# EAGLE design Jumper Board V3.0 (EAGLE 9.6.2)
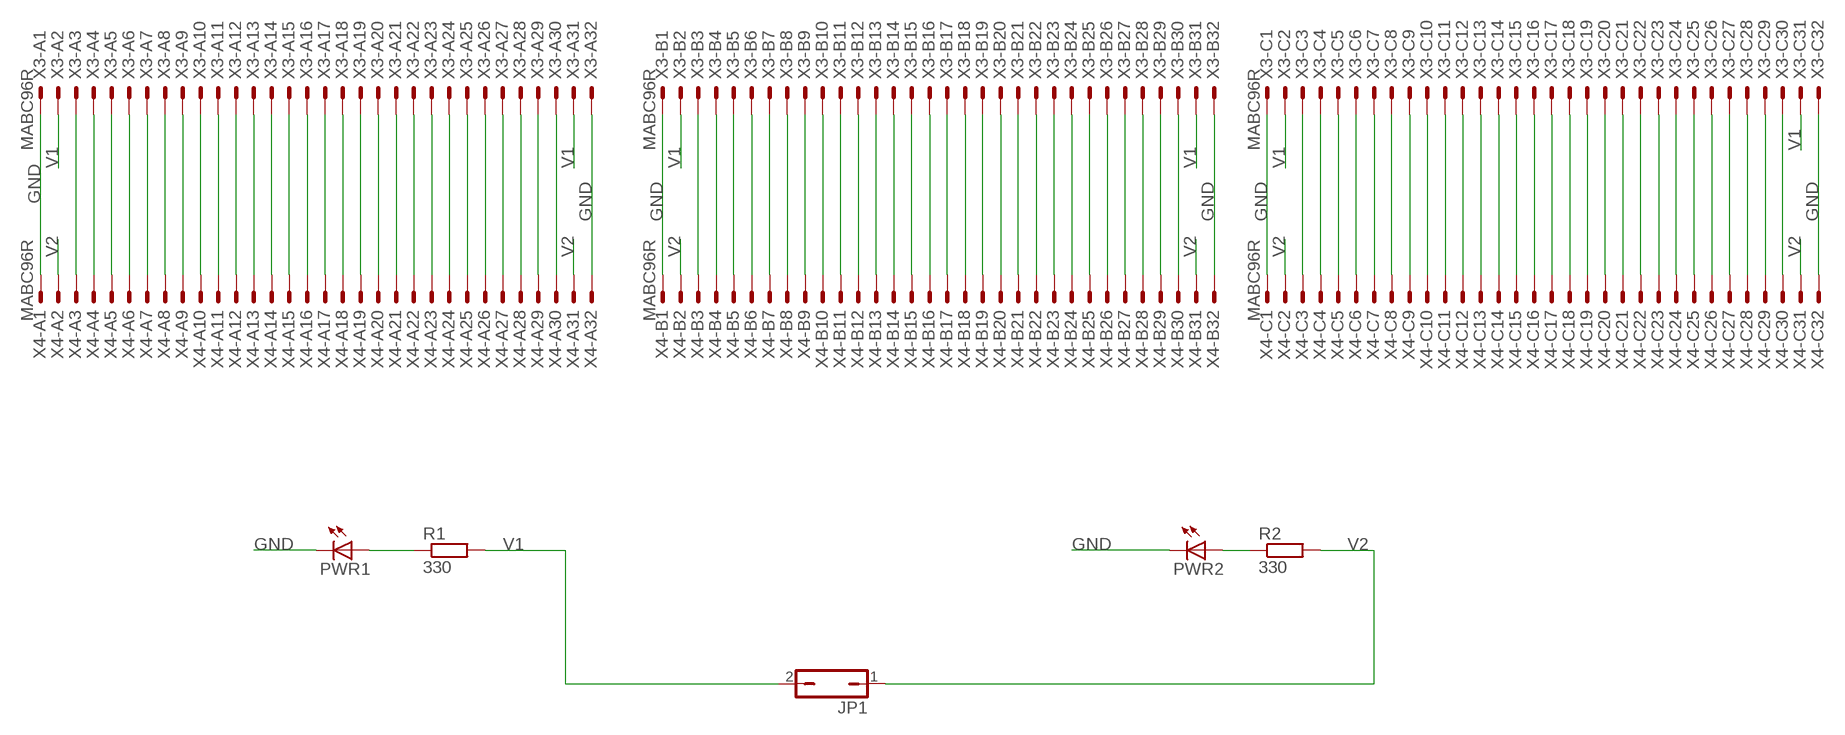
[diagram p0: schematic, sheet 1]

## Parts
JP1  JP1Q  [JP1]
PWR1  LED5MM  [LED5MM]
PWR2  LED5MM  [LED5MM]
R1  330  R0207/10  [0207/10]
R2  330  R0207/10  [0207/10]
X3  MABC96R  [MABC96R]
X4  MABC96R  [MABC96R]

## Nets
GND [GND]: PWR1.K(C) PWR2.K(C) X3.A1 X3.A32 X3.B1 X3.B32 X3.C1 X3.C32 X4.A1 X4.A32 X4.B1 X4.B32 X4.C1 X4.C32
N$4: X3.A3 X4.A3
N$6: X3.A4 X4.A4
N$7: X3.A5 X4.A5
N$8: X3.A6 X4.A6
N$9: X3.A7 X4.A7
N$10: X3.A8 X4.A8
N$11: X3.A9 X4.A9
N$12: X3.A10 X4.A10
N$13: X3.A11 X4.A11
N$14: X3.A12 X4.A12
N$15: X3.A13 X4.A13
N$16: X3.A14 X4.A14
N$17: X3.A15 X4.A15
N$18: X3.A16 X4.A16
N$19: X3.A17 X4.A17
N$20: X3.A18 X4.A18
N$21: X3.A19 X4.A19
N$22: X3.A20 X4.A20
N$23: X3.A21 X4.A21
N$24: X3.A22 X4.A22
N$25: X3.A23 X4.A23
N$26: X3.A24 X4.A24
N$27: X3.A25 X4.A25
N$28: X3.A26 X4.A26
N$29: X3.A27 X4.A27
N$30: X3.A28 X4.A28
N$31: X3.A29 X4.A29
N$32: X3.A30 X4.A30
N$35: PWR1.A R1.1
N$36: PWR2.A R2.1
N$37: X3.B3 X4.B3
N$38: X3.B4 X4.B4
N$39: X3.B5 X4.B5
N$40: X3.B6 X4.B6
N$41: X3.B7 X4.B7
N$42: X3.B8 X4.B8
N$43: X3.B9 X4.B9
N$44: X3.B10 X4.B10
N$45: X3.B11 X4.B11
N$46: X3.B12 X4.B12
N$47: X3.B13 X4.B13
N$48: X3.B14 X4.B14
N$49: X3.B15 X4.B15
N$50: X3.B16 X4.B16
N$51: X3.B17 X4.B17
N$52: X3.B18 X4.B18
N$53: X3.B19 X4.B19
N$54: X3.B20 X4.B20
N$55: X3.B21 X4.B21
N$56: X3.B22 X4.B22
N$57: X3.B23 X4.B23
N$58: X3.B24 X4.B24
N$59: X3.B25 X4.B25
N$60: X3.B26 X4.B26
N$61: X3.B27 X4.B27
N$62: X3.B28 X4.B28
N$63: X3.B29 X4.B29
N$64: X3.B30 X4.B30
N$69: X3.C3 X4.C3
N$70: X3.C4 X4.C4
N$71: X3.C5 X4.C5
N$72: X3.C6 X4.C6
N$73: X3.C7 X4.C7
N$74: X3.C8 X4.C8
N$75: X3.C9 X4.C9
N$76: X3.C10 X4.C10
N$77: X3.C11 X4.C11
N$78: X3.C12 X4.C12
N$79: X3.C13 X4.C13
N$80: X3.C14 X4.C14
N$81: X3.C15 X4.C15
N$82: X3.C16 X4.C16
N$83: X3.C17 X4.C17
N$84: X3.C18 X4.C18
N$85: X3.C19 X4.C19
N$86: X3.C20 X4.C20
N$87: X3.C21 X4.C21
N$88: X3.C22 X4.C22
N$89: X3.C23 X4.C23
N$90: X3.C24 X4.C24
N$91: X3.C25 X4.C25
N$92: X3.C26 X4.C26
N$93: X3.C27 X4.C27
N$94: X3.C28 X4.C28
N$95: X3.C29 X4.C29
N$96: X3.C30 X4.C30
V1 [VCC2]: JP1.2 R1.2 X3.A2 X3.A31 X3.B2 X3.B31 X3.C2 X3.C31
V2 [VCC1]: JP1.1 R2.2 X4.A2 X4.A31 X4.B2 X4.B31 X4.C2 X4.C31

## Library data of the parts
JP1 = jumper:JP1Q: JUMPER
PWR1 PWR2 = led:LED: LED OSRAM: - CHIPLED LG R971, LG N971, LY N971, LG Q971, LY Q971, LO R971, LY R971 LH N974, LH R974 LS Q976, LO Q976, LY Q976 LO Q996 - Hyper CHIPLED LW Q18S LB Q993, LB Q99A, LB R99A - SideLED LS A670, LO A670, LY A670, LG A670, LP A670 LB A673, LV A673, LT A673, LW A673 LH A674 LY A675 LS A676, LA A676, LO A676, LY A676, LW A676 LS A679, LY A679, LG A679 - Hyper Micro SIDELED® LS Y876, LA Y876, LO Y876, LY Y876 LT Y87S - SmartLED LW L88C, LW L88S LB L89C, LB L89S, LG L890 LS L89K, LO L89K, LY L89K LS L896, LA L896, LO L896, LY L896 - TOPLED LS T670, LO T670, LY T670, LG T670, LP T670 LSG T670, LSP T670, LSY T670, LOP T670, LYG T670 LG T671, LOG T671, LSG T671 LB T673, LV T673, LT T673, LW T673 LH T674 LS T676, LA T676, LO T676, LY T676, LB T676, LH T676, LSB T676, LW T676 LB T67C, LV T67C, LT T67C, LS T67K, LO T67K, LY T67K, LW E67C LS E67B, LA E67B, LO E67B, LY E67B, LB E67C, LV E67C, LT E67C LW T67C LS T679, LY T679, LG T679 LS T770, LO T770, LY T770, LG T770, LP T770 LB T773, LV T773, LT T773, LW T773 LH T774 LS E675, LA E675, LY E675, LS T675 LS T776, LA T776, LO T776, LY T776, LB T776 LHGB T686 LT T68C, LB T68C - Hyper Mini TOPLED® LB M676 - Mini TOPLED Santana® LG M470 LS M47K, LO M47K, LY M47K Source: http://www.osram.convergy.de LUXEON: - LUMILED® LXK2-PW12-R00, LXK2-PW12-S00, LXK2-PW14-U00, LXK2-PW14-V00 LXK2-PM12-R00, LXK2-PM12-S00, LXK2-PM14-U00 LXK2-PE12-Q00, LXK2-PE12-R00, LXK2-PE12-S00, LXK2-PE14-T00, LXK2-PE14-U00 LXK2-PB12-K00, LXK2-PB12-L00, LXK2-PB12-M00, LXK2-PB14-N00, LXK2-PB14-P00, LXK2-PB14-Q00 LXK2-PR12-L00, LXK2-PR12-M00, LXK2-PR14-Q00, LXK2-PR14-R00 LXK2-PD12-Q00, LXK2-PD12-R00, LXK2-PD12-S00 LXK2-PH12-R00, LXK2-PH12-S00 LXK2-PL12-P00, LXK2-PL12-Q00, LXK2-PL12-R00 Source: www.luxeon.com KINGBRIGHT: KA-3528ASYC Source: www.kingbright.com
R1 R2 = eagle-ltspice:R: RESISTOR, European symbol; SPICEMODEL: NONE; SPICEPREFIX: R
X3 X4 = con-vg:MABC96R: CONNECTOR male, 96 pins, type R, rows ABC, grid 2.54 mm

## Net classes
1 GND: width 0.508 mm, clearance 0.508 mm
2 VCC1: width 0.508 mm, clearance 0.508 mm
3 VCC2: width 0.508 mm, clearance 0.508 mm

## Board
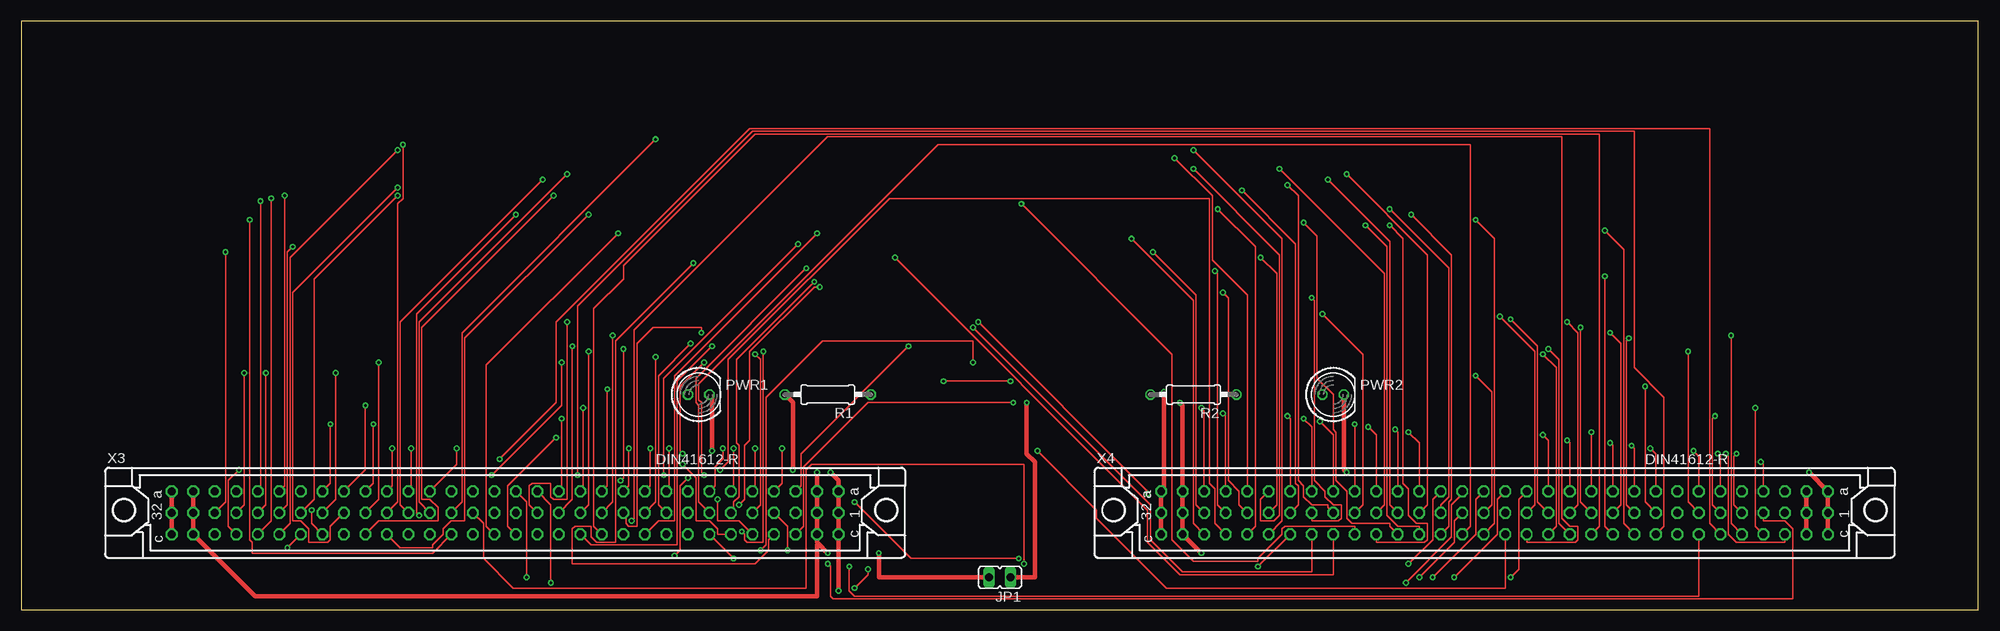
[diagram p1: board, top side]
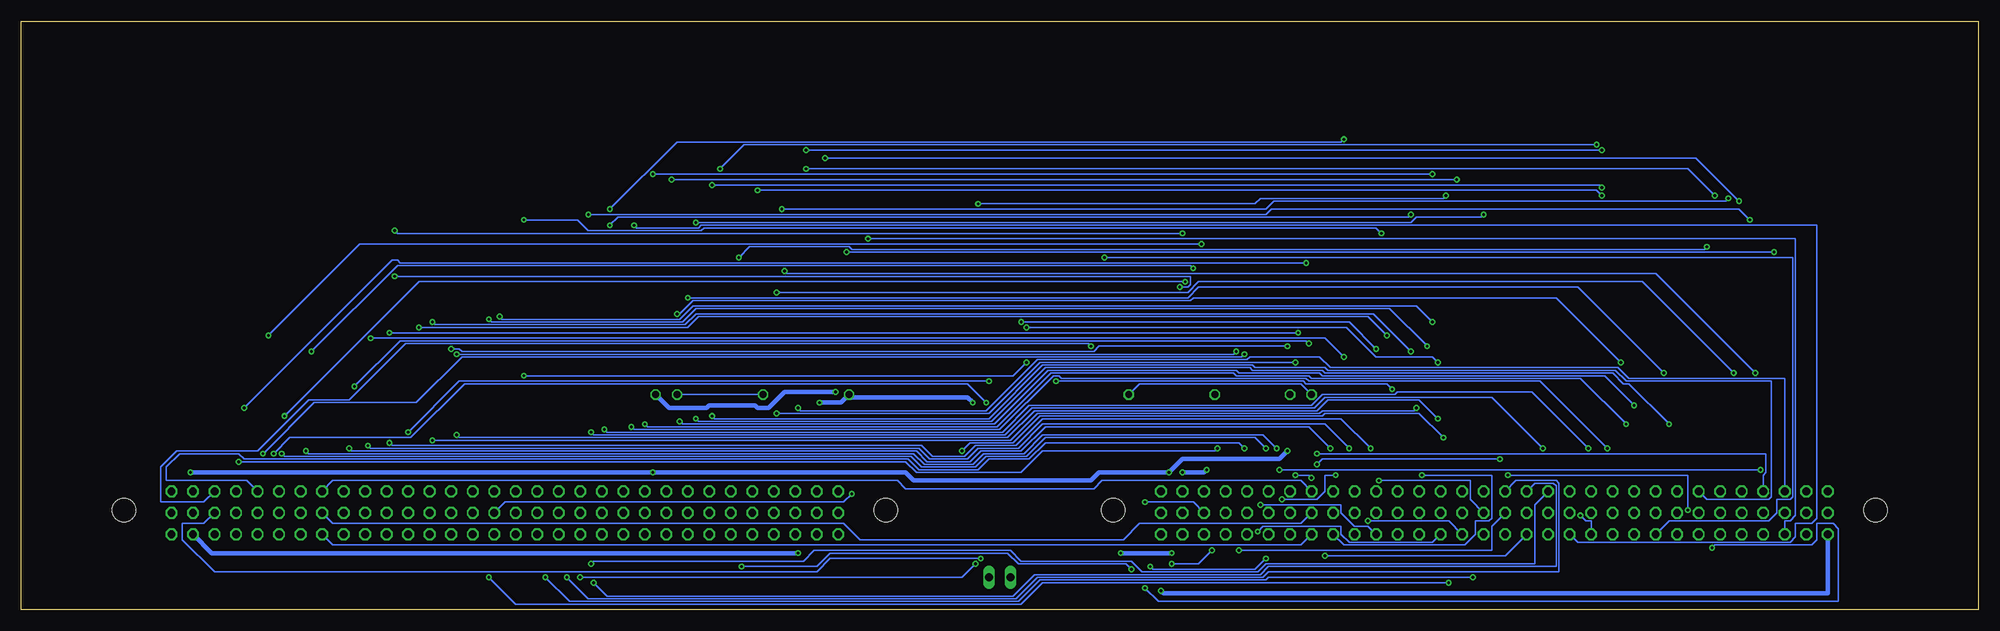
[diagram p2: board, bottom side, seen from below]

Size 231.12 x 69.52 mm. Coordinates in mm from the lower left corner, seen from the top.
Outline: 0,0 231.12,0 231.12,69.52 0,69.52 0,0
Copper layers (1*16): Top 0.0356mm / dielectric 1.5011mm / Bottom 0.0356mm
Design rules "LaenPCBOrder": minimum track width 6mil, minimum drill 13mil, track to track 6mil, track to pad 6mil, pad to pad 6mil, via to via 6mil, smd to smd 6mil, copper to edge 15mil, drill to drill 6mil, minimum pad ring 7mil, minimum via ring 7mil, stop-mask expansion 3mil, vias tented up to drill 0mil, thermal gap 10mil

### Footprints (pad centres in the part's own frame; a part is rotated, then mirrored left to right if it is on the bottom)
JP1 = drill 0.914 long: 1 0,-1.27; 2 0,1.27
LED5MM = drill 0.813 octagon: A -1.27,0; K 1.27,0
0207/10 = drill 0.813 octagon: 1 -5.08,0; 2 5.08,0
MABC96R = drill 0.914 octagon: A1 -2.54,39.37; A2 -2.54,36.83; A3 -2.54,34.29; A4 -2.54,31.75; A5 -2.54,29.21; A6 -2.54,26.67; A7 -2.54,24.13; A8 -2.54,21.59; A9 -2.54,19.05; A10 -2.54,16.51; A11 -2.54,13.97; A12 -2.54,11.43; A13 -2.54,8.89; A14 -2.54,6.35; A15 -2.54,3.81; A16 -2.54,1.27; A17 -2.54,-1.27; A18 -2.54,-3.81; A19 -2.54,-6.35; A20 -2.54,-8.89; A21 -2.54,-11.43; A22 -2.54,-13.97; A23 -2.54,-16.51; A24 -2.54,-19.05; A25 -2.54,-21.59; A26 -2.54,-24.13; A27 -2.54,-26.67; A28 -2.54,-29.21; A29 -2.54,-31.75; A30 -2.54,-34.29; A31 -2.54,-36.83; A32 -2.54,-39.37; B1 0,39.37; B2 0,36.83; B3 0,34.29; B4 0,31.75; B5 0,29.21; B6 0,26.67; B7 0,24.13; B8 0,21.59; B9 0,19.05; B10 0,16.51; B11 0,13.97; B12 0,11.43; B13 0,8.89; B14 0,6.35; B15 0,3.81; B16 0,1.27; B17 0,-1.27; B18 0,-3.81; B19 0,-6.35; B20 0,-8.89; B21 0,-11.43; B22 0,-13.97; B23 0,-16.51; B24 0,-19.05; B25 0,-21.59; B26 0,-24.13; B27 0,-26.67; B28 0,-29.21; B29 0,-31.75; B30 0,-34.29; B31 0,-36.83; B32 0,-39.37; C1 2.54,39.37; C2 2.54,36.83; C3 2.54,34.29; C4 2.54,31.75; C5 2.54,29.21; C6 2.54,26.67; C7 2.54,24.13; C8 2.54,21.59; C9 2.54,19.05; C10 2.54,16.51; C11 2.54,13.97; C12 2.54,11.43; C13 2.54,8.89; C14 2.54,6.35; C15 2.54,3.81; C16 2.54,1.27; C17 2.54,-1.27; C18 2.54,-3.81; C19 2.54,-6.35; C20 2.54,-8.89; C21 2.54,-11.43; C22 2.54,-13.97; C23 2.54,-16.51; C24 2.54,-19.05; C25 2.54,-21.59; C26 2.54,-24.13; C27 2.54,-26.67; C28 2.54,-29.21; C29 2.54,-31.75; C30 2.54,-34.29; C31 2.54,-36.83; C32 2.54,-39.37 | hole 2.794: -0.305,45; -0.305,-45

### Placement (x,y rotation side)
JP1  115.57,3.81 90 top
PWR1  80.01,25.4 0 top
PWR2  154.94,25.4 0 top
R1  95.25,25.4 180 top
R2  138.43,25.4 180 top
X3  57.15,11.43 270 top
X4  173.99,11.43 270 top

### Tracks (layer width: path | path; a pad name or v marks a point on that pad's centre or on a via)
GND  (via drill 0.33)
  Top 0.508: X4.C1 X4.B1 X4.A1 v211.14,16.19 | X4.C32 X4.B32 X4.A32 134.94,14.29 v134.94,25.72 | v156.53,16.19 156.21,16.51 PWR2.K | X3.C32 X3.B32 X3.A32 | PWR1.K 81.6,25.08 v81.6,18.73 | v95.57,16.19 96.52,15.24 X3.A1 X3.B1 X3.C1 v96.52,2.22
  Bottom 0.508: PWR2.K 154.62,23.81 150.18,23.81 149.86,24.13 144.46,24.13 144.15,23.81 142.88,23.81 140.97,25.72 v134.94,25.72 | v211.14,16.19 v156.53,16.19 126.68,16.19 125.73,15.24 104.78,15.24 103.82,16.19 v95.57,16.19 93.98,17.78 82.55,17.78 v81.6,18.73 | X3.C32 17.78,1.91 96.2,1.91 v96.52,2.22
N$4  (via drill 0.33)
  Top 0.152: X3.A3 92.08,14.61 92.08,18.41 v104.78,31.11
  Bottom 0.152: v104.78,31.11 105.09,31.43 185.74,31.43 192.41,24.77 197.17,24.77 203.2,18.73 212.72,18.73 214.63,16.83 214.63,12.7 209.55,12.7 X4.A3
N$6  (via drill 0.33)
  Top 0.152: X3.A4 89.85,14.92 v89.85,19.05 | v205.42,17.46 205.74,17.14 X4.A4
  Bottom 0.152: v89.85,19.05 90.17,18.73 110.49,18.73 113.03,16.19 125.41,16.19 126.68,17.46 v205.42,17.46
N$7  (via drill 0.33)
  Top 0.152: X3.A5 86.68,14.29 v86.68,19.05
  Bottom 0.152: v86.68,19.05 87.31,19.68 110.17,19.68 112.08,17.78 116.84,17.78 118.11,16.51 125.09,16.51 126.36,17.78 204.79,17.78 205.42,18.41 212.41,18.41 214,16.83 214,15.24 204.47,15.24 X4.A5
N$8  (via drill 0.33)
  Top 0.152: X3.A6 84.14,14.29 v84.14,19.05 | v200.34,18.41 200.66,18.1 X4.A6
  Bottom 0.152: v84.14,19.05 85.41,20.32 110.17,20.32 112.39,18.1 117.16,18.1 118.43,16.83 124.78,16.83 126.05,18.1 200.03,18.1 v200.34,18.41
N$9  (via drill 0.33)
  Top 0.152: X3.A7 81.92,14.61 81.92,16.83 82.87,17.78 v82.87,19.05 | v197.49,18.73 198.12,18.1 X4.A7
  Bottom 0.152: v82.87,19.05 84.45,20.64 110.49,20.64 112.71,18.41 117.47,18.41 118.75,17.14 124.46,17.14 125.73,18.41 197.17,18.41 v197.49,18.73
N$10
  Bottom 0.152: X3.A8 80.01,15.24 103.5,15.24 104.46,14.29 126.68,14.29 127.64,15.24 194.31,15.24 X4.A8
N$11  (via drill 0.33)
  Top 0.152: X3.A9 76.52,14.29 v76.52,19.05 | v192.41,19.05 193.04,18.41 X4.A9
  Bottom 0.152: v76.52,19.05 79.06,21.59 110.17,21.59 113.03,18.73 117.79,18.73 119.06,17.46 124.14,17.46 125.41,18.73 192.09,18.73 v192.41,19.05
N$12  (via drill 0.33)
  Top 0.152: X3.A10 74.3,14.61 v74.3,19.05 | v190.18,19.37 190.5,19.05 X4.A10
  Bottom 0.152: v74.3,19.05 77.15,21.91 110.49,21.91 113.35,19.05 118.11,19.05 119.38,17.78 123.83,17.78 125.09,19.05 189.87,19.05 v190.18,19.37
N$13  (via drill 0.33)
  Top 0.152: X3.A11 71.75,14.61 v71.75,19.05 | v187.64,19.68 187.96,19.37 X4.A11
  Bottom 0.152: v71.75,19.05 75.25,22.54 110.49,22.54 113.67,19.37 118.43,19.37 119.7,18.1 123.51,18.1 124.78,19.37 187.32,19.37 v187.64,19.68
N$14  (via drill 0.33)
  Top 0.152: X3.A12 69.22,14.61 v69.22,26.04 | v116.84,26.99 v108.9,26.99 | X4.A12 v185.42,20.95
  Bottom 0.152: v69.22,26.04 69.85,26.67 79.38,26.67 79.69,26.99 v108.9,26.99 | v116.84,26.99 179.39,26.99 v185.42,20.95
N$15  (via drill 0.33)
  Top 0.152: X3.A13 66.36,14.29 v66.36,23.81 | v182.56,20 182.88,19.68 X4.A13
  Bottom 0.152: v66.36,23.81 66.67,23.5 77.47,23.5 77.79,23.18 111.12,23.18 114.3,20 v182.56,20
N$16  (via drill 0.33)
  Top 0.152: X3.A14 63.82,14.29 v63.82,22.54 | v179.71,20.64 180.34,20 X4.A14
  Bottom 0.152: v63.82,22.54 66.04,24.77 76.83,24.77 78.11,23.5 111.44,23.5 114.62,20.32 179.39,20.32 v179.71,20.64
N$17  (via drill 0.33)
  Top 0.152: X3.A15 62.55,12.38 v62.55,3.17 | v175.9,3.81 176.85,4.76 176.85,13.02 X4.A15
  Bottom 0.152: v62.55,3.17 110.49,3.17 113.03,0.64 172.72,0.64 v175.9,3.81
N$18  (via drill 0.33)
  Top 0.152: X3.A16 59.69,12.7 v59.69,3.81 | v169.23,3.81 174.31,8.89 174.31,13.02 X4.A16
  Bottom 0.152: v59.69,3.81 83.82,3.81 84.14,3.49 110.81,3.49 113.35,0.95 166.37,0.95 v169.23,3.81
N$19  (via drill 0.33)
  Top 0.152: v166.69,3.81 171.77,8.89 171.77,13.02 X4.A17
  Bottom 0.152: X3.A17 54.61,15.24 49.85,15.24 49.53,14.92 49.53,4.45 83.82,4.45 84.45,3.81 111.12,3.81 113.67,1.27 164.15,1.27 v166.69,3.81
N$20  (via drill 0.33)
  Top 0.152: v163.51,3.17 168.91,8.57 168.91,12.38 170.18,13.65 X4.A18
  Bottom 0.152: X3.A18 52.39,14.92 50.16,14.92 49.85,14.61 49.85,5.08 83.82,5.08 84.77,4.13 111.44,4.13 113.98,1.59 161.93,1.59 v163.51,3.17
N$21  (via drill 0.33)
  Top 0.152: v163.83,5.4 166.69,8.26 166.69,13.02 X4.A19
  Bottom 0.152: X3.A19 52.39,12.38 52.39,5.4 84.14,5.4 85.09,4.45 98.74,4.45 100.01,5.71 113.03,5.71 114.3,6.99 137.48,6.99 138.75,5.71 163.51,5.71 v163.83,5.4
N$22  (via drill 0.33)
  Top 0.152: X3.A20 51.44,17.14 v51.44,19.05 | v163.83,20.95 165.1,19.68 X4.A20
  Bottom 0.152: v51.44,19.05 57.47,25.08 77.15,25.08 78.42,23.81 111.76,23.81 114.94,20.64 163.51,20.64 v163.83,20.95
N$23  (via drill 0.33)
  Top 0.152: X3.A21 46.04,14.29 v46.04,19.05 | v162.24,21.27 162.56,20.95 X4.A21
  Bottom 0.152: v46.04,19.05 52.7,25.72 68.58,25.72 68.9,25.4 77.47,25.4 78.74,24.13 112.08,24.13 115.25,20.95 161.93,20.95 v162.24,21.27
N$24  (via drill 0.33)
  Top 0.152: X3.A22 43.81,14.61 v43.81,19.05 | v159.07,21.59 160.02,20.64 X4.A22
  Bottom 0.152: v43.81,19.05 51.75,26.99 79.06,26.99 79.38,27.3 108.27,27.3 108.58,27.62 109.22,27.62 115.57,21.27 158.75,21.27 v159.07,21.59
N$25  (via drill 0.33)
  Top 0.152: X3.A23 41.59,14.92 v41.59,21.91 | X4.A23 v157.48,21.91
  Bottom 0.152: v41.59,21.91 46.99,27.3 78.74,27.3 79.06,27.62 87.63,27.62 87.95,27.94 109.54,27.94 115.89,21.59 157.16,21.59 v157.48,21.91
N$26  (via drill 0.33)
  Top 0.152: X3.A24 40.64,16.51 v40.64,24.13 | v153.35,22.23 154.94,20.64 X4.A24
  Bottom 0.152: v40.64,24.13 44.13,27.62 77.47,27.62 77.79,27.94 87.31,27.94 87.63,28.26 109.86,28.26 116.2,21.91 153.03,21.91 v153.35,22.23
N$27  (via drill 0.33)
  Top 0.152: X3.A25 36.51,14.92 v36.51,21.91 | v151.45,22.54 152.4,21.59 X4.A25
  Bottom 0.152: v36.51,21.91 41.27,26.67 41.91,26.67 43.18,27.94 77.15,27.94 77.47,28.26 85.72,28.26 86.04,28.57 110.17,28.57 116.52,22.23 151.13,22.23 v151.45,22.54
N$28  (via drill 0.33)
  Top 0.152: v149.54,22.86 149.86,22.54 X4.A26
  Bottom 0.152: X3.A26 32.07,13.02 24.77,13.02 24.45,13.34 24.45,26.99 41.59,26.99 42.86,28.26 76.83,28.26 77.15,28.57 85.41,28.57 85.72,28.89 110.49,28.89 116.84,22.54 149.22,22.54 v149.54,22.86
N$29  (via drill 0.33)
  Top 0.152: X3.A27 31.11,14.61 v31.11,48.9 | v138.43,52.07 148.59,41.91 148.59,11.11 147.96,10.48 146.37,10.48 146.37,13.02 X4.A27
  Bottom 0.152: v31.11,48.9 34.29,52.07 v138.43,52.07
N$30  (via drill 0.33)
  Top 0.152: X3.A28 28.26,14.29 v28.26,48.26 | v136.21,53.34 140.65,48.9 140.65,41.27 144.78,37.15 X4.A28
  Bottom 0.152: v28.26,48.26 33.34,53.34 v136.21,53.34
N$31  (via drill 0.33)
  Top 0.152: v78.11,18.41 77.79,18.73 77.79,26.35 v80.64,29.21 | v141.92,23.18 142.24,22.86 X4.A29
  Bottom 0.152: X3.A29 25.4,15.88 25.08,16.19 25.08,18.41 v78.11,18.41 | v80.64,29.21 110.81,29.21 116.84,23.18 v141.92,23.18
N$32  (via drill 0.33)
  Top 0.152: v139.38,23.81 139.7,23.5 X4.A30
  Bottom 0.152: X3.A30 22.86,27.3 41.27,27.3 42.55,28.57 76.52,28.57 77.79,29.84 86.04,29.84 86.36,29.53 111.12,29.53 117.16,23.5 139.06,23.5 v139.38,23.81
N$35
  Bottom 0.152: PWR1.A 80.01,26.67 99.06,26.67 R1.1
N$36
  Bottom 0.152: PWR2.A R2.1
N$37  (via drill 0.33)
  Top 0.152: v98.42,12.7 105.09,6.03 v117.79,6.03
  Bottom 0.152: X3.B3 92.71,12.7 v98.42,12.7 | v117.79,6.03 135.57,6.03 137.16,4.45 208.28,4.45 212.09,8.26 212.09,10.16 209.55,10.16 X4.B3
N$38  (via drill 0.33)
  Top 0.152: X3.B4 90.49,9.84 v90.49,6.99 | v95.25,5.4 95.57,5.08 95.57,1.59 95.89,1.27 209.23,1.27 209.23,9.53 208.28,10.48 205.74,10.48 X4.B4
  Bottom 0.152: v90.49,6.99 92.08,5.4 v95.25,5.4
N$39  (via drill 0.33)
  Top 0.152: X3.B5 87.31,12.38 87.31,29.53 v86.68,30.16 | v202.56,18.41 202.25,18.1 202.25,12.38 X4.B5
  Bottom 0.152: v86.68,30.16 87,29.84 179.07,29.84 184.47,24.45 196.53,24.45 v202.56,18.41
N$40  (via drill 0.33)
  Top 0.152: X3.B6 84.14,11.75 84.14,12.7 84.77,13.34 84.77,19.37 84.45,19.68 84.45,29.53 v93.66,38.73 | v200.03,22.86 199.71,22.54 199.71,12.38 X4.B6
  Bottom 0.152: v93.66,38.73 184.15,38.73 v200.03,22.86
N$41  (via drill 0.33)
  Top 0.152: X3.B7 80.01,12.7 80.01,24.13 79.69,24.45 79.69,27.3 v92.71,40.32 | v196.85,30.48 196.85,12.7 X4.B7
  Bottom 0.152: v92.71,40.32 93.03,40.64 186.69,40.64 v196.85,30.48
N$42
  Bottom 0.152: X3.B8 80.01,10.16 99.06,10.16 100.97,8.26 132.08,8.26 133.99,10.16 194.31,10.16 X4.B8
N$43  (via drill 0.33)
  Top 0.152: X3.B9 75.25,12.38 75.25,27.62 v79.06,31.43 | v191.77,26.35 191.77,12.7 X4.B9
  Bottom 0.152: v79.06,31.43 79.38,31.75 186.37,31.75 v191.77,26.35
N$44  (via drill 0.33)
  Top 0.152: X3.B10 74.93,12.7 v74.93,29.84 | v189.87,32.07 189.55,31.75 189.55,12.38 X4.B10
  Bottom 0.152: v74.93,29.84 77.15,32.07 v189.87,32.07
N$45  (via drill 0.33)
  Top 0.152: X3.B11 71.44,11.11 71.44,10.16 71.75,9.84 72.71,9.84 72.71,31.43 74.61,33.34 80.33,33.34 v80.33,32.7 | v187.64,32.7 188.91,31.43 188.91,12.38 X4.B11
  Bottom 0.152: v187.64,32.7 v80.33,32.7
N$46  (via drill 0.33)
  Top 0.152: X3.B12 69.85,12.7 v69.85,32.38 | v184.15,33.34 184.15,12.7 X4.B12
  Bottom 0.152: v69.85,32.38 72.07,34.61 151.13,34.61 152.4,33.34 v184.15,33.34
N$47  (via drill 0.33)
  Top 0.152: X3.B13 66.99,12.38 v66.99,30.48 | v182.56,33.97 183.83,32.7 183.83,12.38 X4.B13
  Bottom 0.152: v66.99,30.48 71.44,34.92 151.45,34.92 152.72,33.66 182.25,33.66 v182.56,33.97
N$48  (via drill 0.33)
  Top 0.152: X3.B14 65.09,13.02 v65.09,31.11 | v175.9,34.29 179.07,31.11 179.07,12.7 X4.B14
  Bottom 0.152: v65.09,31.11 69.53,35.56 151.45,35.56 153.03,33.97 175.58,33.97 v175.9,34.29
N$49  (via drill 0.33)
  Top 0.152: X3.B15 60.01,12.38 60.01,14.61 60.33,14.92 62.55,14.92 62.55,13.34 62.87,13.02 64.45,13.02 v64.45,33.97 | v174.62,34.61 178.75,30.48 178.75,12.38 X4.B15
  Bottom 0.152: v64.45,33.97 66.36,35.88 151.76,35.88 153.35,34.29 174.31,34.29 v174.62,34.61
N$50  (via drill 0.33)
  Top 0.152: v70.8,15.24 71.12,15.56 v71.12,30.8 | v113.03,33.97 133.03,13.97 v133.03,13.65
  Bottom 0.152: X3.B16 60.01,13.02 60.01,15.24 v70.8,15.24 | v71.12,30.8 74.3,33.97 v113.03,33.97 | v133.03,13.65 133.99,12.7 173.99,12.7 X4.B16
N$51  (via drill 0.33)
  Top 0.152: v87.31,6.99 87.95,7.62 87.95,25.08 94.61,31.75 112.39,31.75 v112.39,29.21 | v171.77,27.62 173.67,25.72 173.67,12.38 X4.B17
  Bottom 0.152: X3.B17 57.47,9.84 57.47,6.99 v87.31,6.99 | v112.39,29.21 113.98,27.62 v171.77,27.62
N$52  (via drill 0.33)
  Top 0.152: X3.B18 54.61,10.16 54.61,6.03 58.1,2.54 92.71,2.54 92.71,16.51 93.34,17.14 118.43,17.14 v118.43,5.4 | v165.1,3.81 169.23,7.94 169.23,10.48 X4.B18
  Bottom 0.152: v118.43,5.4 120.02,3.81 v165.1,3.81
N$53  (via drill 0.33)
  Top 0.152: X3.B19 52.07,12.7 52.07,32.7 v74.93,55.56 | v161.61,47.31 168.59,40.32 168.59,13.34 167.64,12.38 X4.B19
  Bottom 0.152: v74.93,55.56 75.25,55.24 153.67,55.24 v161.61,47.31
N$54  (via drill 0.33)
  Top 0.152: X3.B20 46.99,12.7 46.99,33.97 v64.45,51.44 | v156.53,51.44 166.05,41.91 166.05,12.38 X4.B20
  Bottom 0.152: v156.53,51.44 v64.45,51.44
N$55  (via drill 0.33)
  Top 0.152: X3.B21 44.77,12.38 44.77,33.97 v61.59,50.8 | v154.31,50.8 161.61,43.5 161.61,12.38 X4.B21
  Bottom 0.152: v154.31,50.8 v61.59,50.8
N$56  (via drill 0.33)
  Top 0.152: X3.B22 44.45,12.7 44.45,47.94 45.09,48.58 v45.09,54.93 | v148.59,52.07 160.97,39.69 160.97,12.38 X4.B22
  Bottom 0.152: v45.09,54.93 145.73,54.93 v148.59,52.07
N$57  (via drill 0.33)
  Top 0.152: X3.B23 42.23,13.02 v42.23,29.21 | v153.67,34.92 158.43,30.16 158.43,12.38 X4.B23
  Bottom 0.152: v42.23,29.21 49.85,36.83 92.71,36.83 93.03,36.51 151.76,36.51 153.35,34.92 v153.67,34.92
N$58  (via drill 0.33)
  Top 0.152: X3.B24 36.51,9.84 36.51,8.26 36.2,7.94 33.97,7.94 33.97,9.53 33.02,10.48 32.07,10.48 32.07,37.47 v44.45,49.85 | v149.54,50.16 150.81,48.9 150.81,15.24 151.45,14.61 151.45,13.34 152.4,12.38 154.31,12.38 154.31,12.06 X4.B24
  Bottom 0.152: v44.45,49.85 44.77,50.16 v149.54,50.16
N$59  (via drill 0.33)
  Top 0.152: X3.B25 37.15,13.02 v37.15,27.94 | v152.4,36.83 152.72,36.51 152.72,15.24 153.99,13.97 153.99,13.34 154.94,12.38 155.89,12.38 155.89,10.79 155.57,10.48 152.4,10.48 X4.B25
  Bottom 0.152: v37.15,27.94 47.31,38.1 92.08,38.1 93.34,36.83 v152.4,36.83
N$60  (via drill 0.33)
  Top 0.152: X3.B26 34.61,13.02 34.61,39.05 v44.45,48.9 | v144.15,49.53 150.5,43.18 150.5,14.92 150.81,14.61 150.81,12.38 X4.B26
  Bottom 0.152: v44.45,48.9 45.09,49.53 v144.15,49.53
N$61  (via drill 0.33)
  Top 0.152: X3.B27 31.43,12.38 31.43,42.23 v32.07,42.86 | v146.37,41.59 148.27,39.69 148.27,12.38 X4.B27
  Bottom 0.152: v32.07,42.86 32.38,42.55 133.03,42.55 133.35,42.86 145.1,42.86 v146.37,41.59
N$62  (via drill 0.33)
  Top 0.152: X3.B28 28.89,12.38 v28.89,27.94 | v141.92,37.47 142.56,36.83 142.56,15.24 143.83,13.97 143.83,12.38 X4.B28
  Bottom 0.152: v28.89,27.94 39.69,38.73 92.08,38.73 93.34,37.47 v141.92,37.47
N$63  (via drill 0.33)
  Top 0.152: X3.B29 26.35,12.38 v26.35,27.94 | v140.97,40.01 141.29,39.69 141.29,12.38 X4.B29
  Bottom 0.152: v26.35,27.94 38.1,39.69 140.65,39.69 v140.97,40.01
N$64  (via drill 0.33)
  Top 0.152: X3.B30 24.13,12.7 v24.13,42.23 | v133.67,42.23 138.75,37.15 138.75,12.38 X4.B30
  Bottom 0.152: v133.67,42.23 v24.13,42.23
N$69  (via drill 0.33)
  Top 0.152: X3.C3 92.39,9.84 92.39,16.83 100.01,24.45 v117.16,24.45 | v201.29,18.41 201.61,18.1 201.61,8.89 202.56,7.94 208.28,7.94 X4.C3
  Bottom 0.152: v117.16,24.45 119.38,26.67 178.75,26.67 185.1,20.32 199.39,20.32 v201.29,18.41
N$70  (via drill 0.33)
  Top 0.152: X3.C4 88.27,8.26 88.27,6.99 86.68,5.4 65.09,5.4 65.09,9.53 65.41,9.84 67.31,9.84 67.31,8.57 67.94,7.94 70.17,7.94 70.17,31.75 v79.38,40.96 | v204.79,23.81 204.79,9.84 X4.C4
  Bottom 0.152: v79.38,40.96 186.37,40.96 186.69,41.27 187.32,41.27 v204.79,23.81
N$71  (via drill 0.33)
  Top 0.152: X3.C5 84.77,10.48 82.23,10.48 v82.23,13.02 | v75.88,15.88 75.88,27.3 v91.76,43.18 | v201.93,32.38 201.93,10.16 X4.C5
  Bottom 0.152: v82.23,13.02 78.11,13.02 77.15,13.97 77.15,15.88 v75.88,15.88 | v91.76,43.18 191.13,43.18 v201.93,32.38
N$72  (via drill 0.33)
  Top 0.152: X3.C6 82.23,8.89 82.23,9.53 81.28,10.48 79.69,10.48 79.69,15.56 v78.11,17.14 | v56.52,17.78 63.18,24.45 63.18,33.97 86.04,56.83 199.39,56.83 199.39,10.16 X4.C6
  Bottom 0.152: v78.11,17.14 77.47,17.78 v56.52,17.78
N$73  (via drill 0.33)
  Top 0.152: v84.14,6.03 X3.C7 | v97.79,5.08 97.79,2.22 98.42,1.59 198.12,1.59 X4.C7
  Bottom 0.152: v84.14,6.03 85.41,4.76 97.47,4.76 v97.79,5.08
N$74
  Bottom 0.152: X3.C8 80.01,7.62 194.31,7.62 X4.C8
N$75  (via drill 0.33)
  Top 0.152: v65.72,15.88 65.72,35.88 86.36,56.52 190.5,56.52 190.5,28.57 193.99,25.08 193.99,9.84 X4.C9
  Bottom 0.152: X3.C9 74.93,7.62 60.64,7.62 59.37,8.89 59.37,10.48 57.78,10.48 57.47,10.79 57.47,15.88 v65.72,15.88
N$76  (via drill 0.33)
  Top 0.152: X3.C10 75.25,10.48 77.15,10.48 77.15,27.62 v93.98,44.45 | v187.01,44.77 189.23,42.55 189.23,10.16 X4.C10
  Bottom 0.152: v93.98,44.45 186.69,44.45 v187.01,44.77
N$77  (via drill 0.33)
  Top 0.152: v84.77,12.38 85.41,13.02 85.41,19.37 86.04,20 86.04,30.48 93.66,38.1 v94.3,38.1 | v187.01,39.37 187.01,9.84 X4.C11
  Bottom 0.152: X3.C11 72.07,9.84 73.66,9.84 75.25,11.43 75.25,12.38 v84.77,12.38 | v94.3,38.1 93.34,38.1 93.03,38.42 93.03,39.37 v187.01,39.37
N$78
  Top 0.152: X3.C12 67.63,9.84 67.63,35.56 71.12,39.05 71.12,40.64 86.68,56.2 186.37,56.2 186.37,9.84 X4.C12
N$79  (via drill 0.33)
  Top 0.152: X3.C13 67.31,7.62 77.47,7.62 77.47,26.99 v81.6,31.11 | v180.34,30.8 181.61,29.53 181.61,10.16 X4.C13
  Bottom 0.152: v81.6,31.11 103.82,31.11 104.46,30.48 179.07,30.48 179.39,30.8 v180.34,30.8
N$80  (via drill 0.33)
  Top 0.152: v85.09,9.21 85.41,8.89 85.41,8.26 85.72,7.94 87.63,7.94 v87.63,30.48 | v179.71,30.16 181.29,28.57 181.29,9.84 X4.C14
  Bottom 0.152: X3.C14 64.45,7.94 74.3,7.94 75.25,8.89 75.25,9.84 84.45,9.84 v85.09,9.21 | v87.63,30.48 87.95,30.16 v179.71,30.16
N$81  (via drill 0.33)
  Top 0.152: v72.07,10.48 72.39,10.79 72.39,33.02 95.25,55.88 181.93,55.88 181.93,10.79 182.88,9.84 183.83,9.84 183.83,8.26 183.51,7.94 177.8,7.94 X4.C15
  Bottom 0.152: X3.C15 62.55,10.48 v72.07,10.48
N$82  (via drill 0.33)
  Top 0.152: X3.C16 57.47,9.84 57.47,14.61 v63.18,20.32 | v120.02,18.73 127,11.75 127,10.79 135.25,2.54 175.26,2.54 X4.C16
  Bottom 0.152: v63.18,20.32 66.04,23.18 77.15,23.18 77.47,22.86 110.81,22.86 113.98,19.68 119.06,19.68 v120.02,18.73
N$83  (via drill 0.33)
  Top 0.152: X3.C17 54.93,9.84 54.93,28.89 v70.48,44.45 | v171.77,46.04 173.99,43.81 173.99,10.16 X4.C17
  Bottom 0.152: v70.48,44.45 71.12,45.09 150.5,45.09 150.81,44.77 164.15,44.77 165.42,46.04 v171.77,46.04
N$84  (via drill 0.33)
  Top 0.152: v77.15,6.35 77.79,6.99 77.79,14.61 v78.74,15.56 | v80.64,15.88 80.33,16.19 80.33,24.45 80.01,24.77 80.01,26.67 108.27,54.93 171.13,54.93 171.13,9.84 X4.C18
  Bottom 0.152: X3.C18 55.88,6.35 v77.15,6.35 | v78.74,15.56 79.06,15.88 v80.64,15.88
N$85  (via drill 0.33)
  Top 0.152: X3.C19 48.58,6.67 27.3,6.67 27.3,7.94 26.99,8.26 v26.99,46.04 | v164.15,46.67 168.91,41.91 168.91,13.02 168.59,12.7 168.59,9.84 X4.C19
  Bottom 0.152: v26.99,46.04 28.26,47.31 83.5,47.31 84.14,46.67 v164.15,46.67
N$86  (via drill 0.33)
  Top 0.152: v158.75,45.4 161.29,42.86 161.29,11.11 162.56,9.84 165.1,9.84 X4.C20
  Bottom 0.152: X3.C20 47.31,7.94 22.23,7.94 21.59,8.57 21.59,10.16 19.68,10.16 19.05,10.79 19.05,45.4 150.81,45.4 151.13,45.09 158.43,45.09 v158.75,45.4
N$87  (via drill 0.33)
  Top 0.152: v46.99,11.11 46.67,11.43 46.67,34.92 v58.42,46.67 | v151.45,45.72 153.03,44.13 153.03,27.3 154.94,25.4 154.94,21.27 155.26,20.95 155.26,15.24 156.53,13.97 156.53,10.79 157.16,10.16 161.61,10.16 161.61,9.84 X4.C21
  Bottom 0.152: X3.C21 45.72,10.48 46.35,10.48 v46.99,11.11 | v58.42,46.67 58.74,46.35 66.36,46.35 66.99,45.72 v151.45,45.72
N$88  (via drill 0.33)
  Top 0.152: X3.C22 44.77,7.3 48.58,7.3 48.58,7.62 49.85,8.89 49.85,9.53 50.8,10.48 52.39,10.48 52.39,32.07 v66.99,46.67 | v161.61,45.4 163.19,43.81 163.19,14.92 163.83,14.29 163.83,11.11 164.78,10.16 166.05,10.16 166.05,8.26 165.74,7.94 160.02,7.94 X4.C22
  Bottom 0.152: v66.99,46.67 67.31,46.35 160.66,46.35 v161.61,45.4
N$89  (via drill 0.33)
  Top 0.152: X3.C23 42.23,10.48 49.21,10.48 49.21,12.06 48.26,13.02 47.31,13.02 47.31,33.34 v62.87,48.9 | v118.11,47.94 135.89,30.16 135.89,8.26 138.43,5.71 146.05,5.71 146.05,6.03 148.91,8.89 148.91,9.53 149.22,9.84 157.48,9.84 X4.C23
  Bottom 0.152: v62.87,48.9 63.18,48.58 84.77,48.58 85.41,47.94 v118.11,47.94
N$90  (via drill 0.33)
  Top 0.152: v103.19,41.59 133.03,11.75 133.03,7.94 136.84,4.13 154.94,4.13 X4.C24
  Bottom 0.152: X3.C24 36.51,10.48 24.77,10.48 23.81,11.43 23.81,13.02 22.23,13.02 21.91,13.34 21.91,41.59 v103.19,41.59
N$91  (via drill 0.33)
  Top 0.152: X3.C25 34.29,10.16 v34.29,11.75 | v55.56,15.88 63.82,24.13 v63.82,29.21 | v112.39,33.34 133.35,12.38 133.35,8.26 137.16,4.45 152.4,4.45 X4.C25
  Bottom 0.152: v34.29,11.75 34.29,15.88 v55.56,15.88 | v63.82,29.21 64.45,29.84 71.12,29.84 74.61,33.34 v112.39,33.34
N$92  (via drill 0.33)
  Top 0.152: v31.43,7.3 X3.C26 | v98.42,2.54 100.01,4.13 v100.01,4.76 | X4.C26 v146.05,5.08
  Bottom 0.152: v31.43,7.3 31.11,7.62 19.68,7.62 19.05,8.26 19.05,10.16 17.14,10.16 16.51,9.53 16.51,0.95 96.84,0.95 v98.42,2.54 | v100.01,4.76 100.65,5.4 113.35,5.4 114.62,6.67 135.57,6.67 137.16,5.08 v146.05,5.08
N$93  (via drill 0.33)
  Top 0.152: X3.C27 31.75,10.16 31.75,41.59 v44.45,54.29 | v138.43,54.29 148.91,43.81 148.91,10.48 X4.C27
  Bottom 0.152: v138.43,54.29 v44.45,54.29
N$94  (via drill 0.33)
  Top 0.152: X3.C28 29.53,10.48 v29.53,48.58 | v141.29,47.31 145.73,42.86 145.73,9.84 X4.C28
  Bottom 0.152: v29.53,48.58 29.84,48.26 83.19,48.26 84.14,47.31 v141.29,47.31
N$95  (via drill 0.33)
  Top 0.152: X3.C29 24.45,9.84 24.45,15.24 v25.72,16.51 | v82.55,16.51 83.5,17.46 83.5,29.53 102.55,48.58 140.34,48.58 140.34,14.92 140.97,14.29 140.97,10.16 X4.C29
  Bottom 0.152: v82.55,16.51 v25.72,16.51
N$96  (via drill 0.33)
  Top 0.152: v131.13,43.81 138.43,36.51 138.43,10.16 X4.C30
  Bottom 0.152: X3.C30 22.86,10.48 22.23,10.48 21.59,11.11 21.59,43.81 v131.13,43.81
V1  (via drill 0.33)
  Top 0.508: R1.2 91.12,24.45 v91.12,16.51 | v93.98,16.19 X3.A2 X3.B2 X3.C2 93.98,7.94 94.14,7.78 | X3.A31 X3.B31 X3.C31 27.62,1.59 93.98,1.59 93.98,7.62 94.14,7.78 | JP1.2 101.28,3.81 v101.28,6.67 | 94.14,7.78 v95.25,6.67
  Bottom 0.508: v91.12,16.51 91.44,16.19 v93.98,16.19 | v95.25,6.67 v101.28,6.67
V2  (via drill 0.33)
  Top 0.508: X4.C2 X4.B2 X4.A2 | v136.84,24.45 137.16,24.13 X4.A31 X4.B31 X4.C31 v139.38,6.67 | JP1.1 119.7,3.81 119.7,17.46 118.75,18.41 v118.75,24.45
  Bottom 0.508: v136.84,24.45 134.3,24.45 R2.2 133.35,25.08 119.38,25.08 v118.75,24.45 | X4.C2 208.6,6.67 v139.38,6.67

### Text on the board
tValues: YACC1 BUS JUMPER BOARD V3.0 | onepagecomputer.com